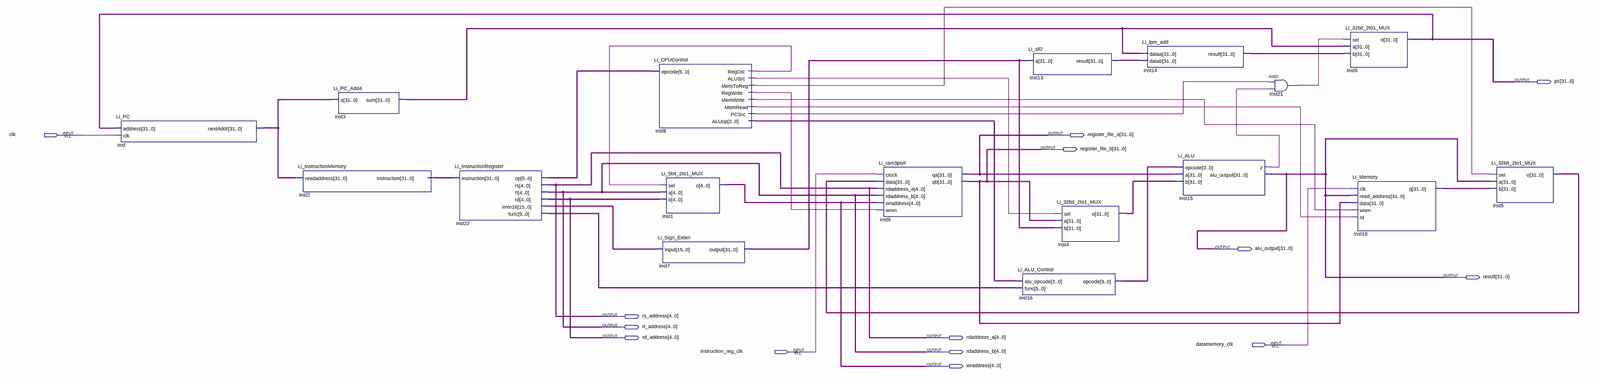
[diagram p0: schematic sheet, whole]
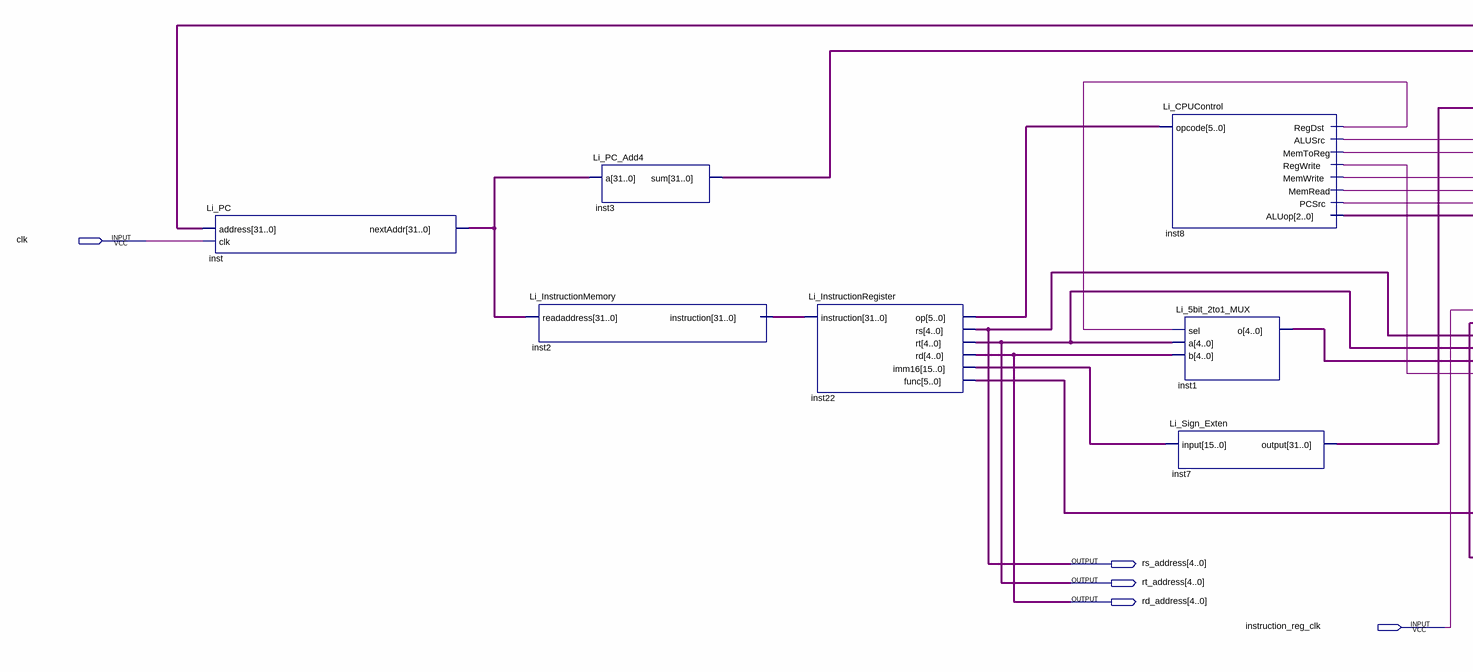
[diagram p1: schematic sheet, left part]
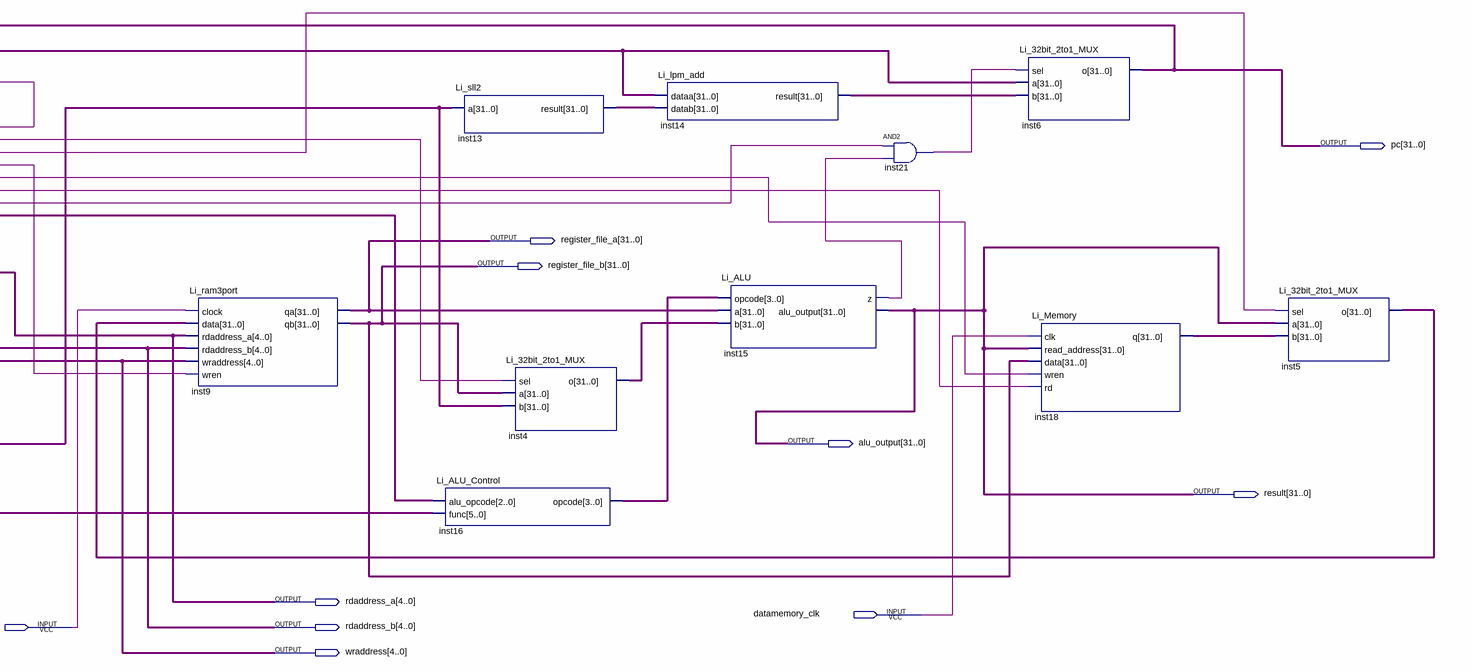
[diagram p2: schematic sheet, right part]
// Quartus schematic single-cycle-cpu-lite.bdf as structural Verilog: 17 symbols, 14 pins
module \single-cycle-cpu-lite  (
  input  clk,
  input  datamemory_clk,
  input  instruction_reg_clk,
  output [31:0] pc,
  output [31:0] register_file_a,
  output [31:0] register_file_b,
  output [31:0] alu_output,
  output [31:0] result,
  output [4:0] rs_address,
  output [4:0] rt_address,
  output [4:0] rd_address,
  output [4:0] rdaddress_a,
  output [4:0] rdaddress_b,
  output [4:0] wraddress
);

  wire inst8_alusrc, inst8_memread, inst8_memtoreg, inst8_memwrite, inst8_pcsrc, inst8_regdst,
       inst8_regwrite, inst15_z, inst21_out;
  wire [2:0] inst8_aluop;
  wire [3:0] inst16_opcode;
  wire [5:0] inst22_func, inst22_op;
  wire [15:0] inst22_imm16;
  wire [31:0] inst2_instruction, inst3_sum, inst4_o, inst5_o, inst7_output, inst13_result, inst14_result,
       inst18_q, inst_nextaddr;

  Li_PC inst (.address(pc), .clk(clk), .nextAddr(inst_nextaddr));
  Li_InstructionMemory inst2 (.readaddress(inst_nextaddr), .instruction(inst2_instruction));
  Li_PC_Add4 inst3 (.a(inst_nextaddr), .sum(inst3_sum));
  Li_InstructionRegister inst22 (
    .instruction(inst2_instruction), .op(inst22_op), .rs(rdaddress_a), .rt(rdaddress_b), .rd(rd_address),
    .imm16(inst22_imm16), .func(inst22_func));
  Li_CPUControl inst8 (
    .opcode(inst22_op), .RegDst(inst8_regdst), .ALUSrc(inst8_alusrc), .MemToReg(inst8_memtoreg),
    .RegWrite(inst8_regwrite), .MemWrite(inst8_memwrite), .MemRead(inst8_memread), .PCSrc(inst8_pcsrc),
    .ALUop(inst8_aluop));
  Li_5bit_2to1_MUX inst1 (.sel(inst8_regdst), .a(rdaddress_b), .b(rd_address), .o(wraddress));
  Li_Sign_Exten inst7 (.\input (inst22_imm16), .\output (inst7_output));
  Li_ram3port inst9 (
    .clock(instruction_reg_clk), .data(inst5_o), .rdaddress_a(rdaddress_a), .rdaddress_b(rdaddress_b),
    .wraddress(wraddress), .wren(inst8_regwrite), .qa(register_file_a), .qb(register_file_b));
  Li_sll2 inst13 (.a(inst7_output), .result(inst13_result));
  Li_ALU_Control inst16 (.alu_opcode(inst8_aluop), .func(inst22_func), .opcode(inst16_opcode));
  Li_32bit_2to1_MUX inst4 (.sel(inst8_alusrc), .a(register_file_b), .b(inst7_output), .o(inst4_o));
  Li_lpm_add inst14 (.dataa(inst3_sum), .datab(inst13_result), .result(inst14_result));
  Li_ALU inst15 (.opcode(inst16_opcode), .a(register_file_a), .b(inst4_o), .z(inst15_z), .alu_output(alu_output));
  and inst21 (inst21_out, inst8_pcsrc, inst15_z);
  Li_32bit_2to1_MUX inst6 (.sel(inst21_out), .a(inst3_sum), .b(inst14_result), .o(pc));
  Li_Memory inst18 (
    .clk(datamemory_clk), .read_address(alu_output), .data(register_file_b), .wren(inst8_memwrite),
    .rd(inst8_memread), .q(inst18_q));
  Li_32bit_2to1_MUX inst5 (.sel(inst8_memtoreg), .a(alu_output), .b(inst18_q), .o(inst5_o));

  assign result = alu_output;
  assign rs_address = rdaddress_a;
  assign rt_address = rdaddress_b;
endmodule
